# Altium project PCB1.PrjPcb
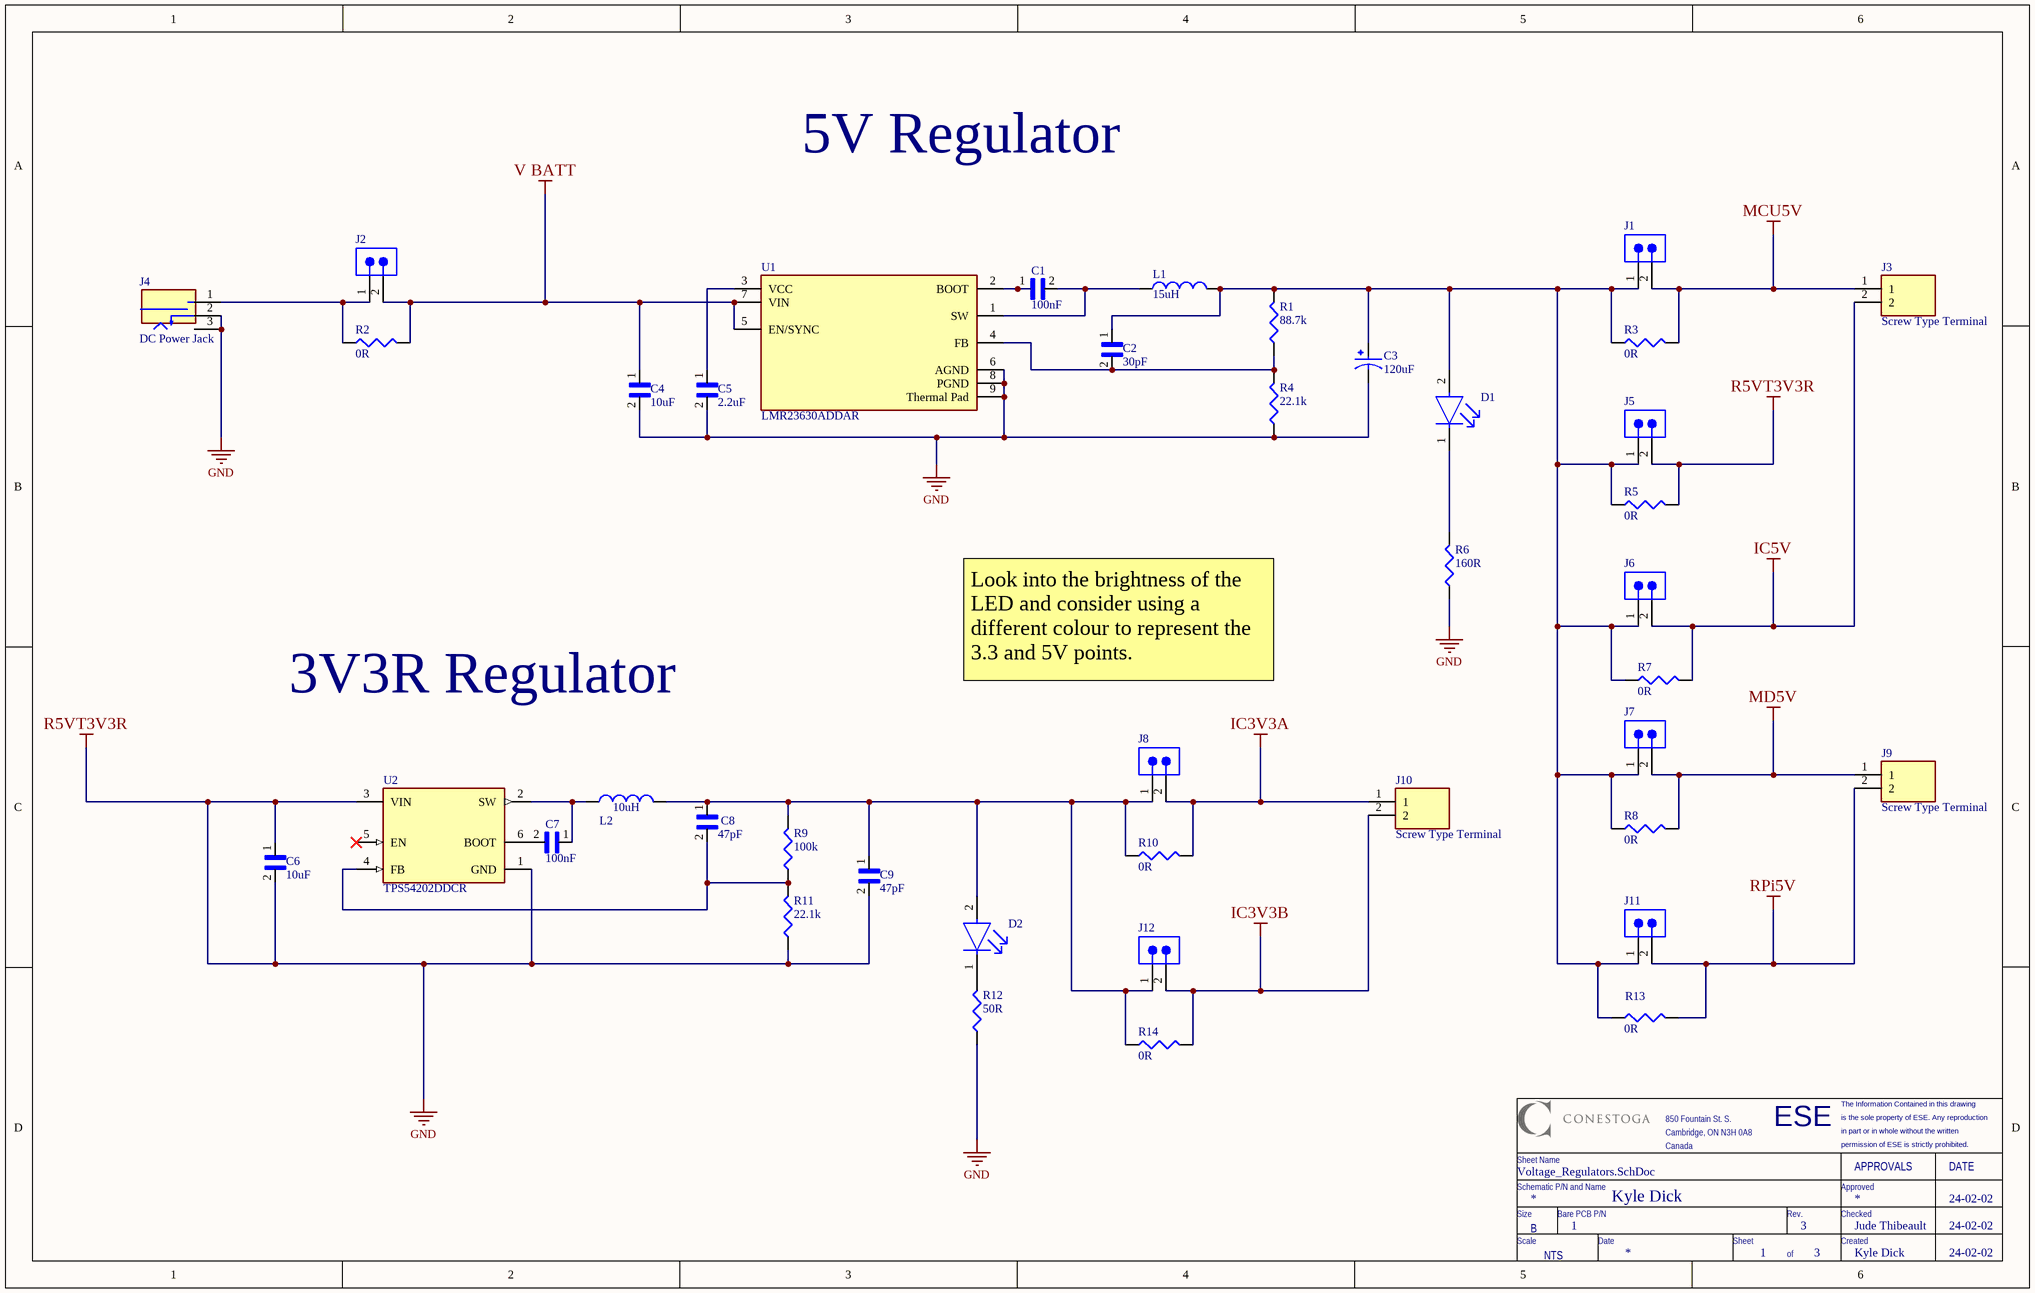
[diagram p0: Voltage_Regulators.SchDoc]
3 sheets, 53 parts. Net scope: flat (ports and power ports of the same name join across sheets).
Board file: PCB1.PcbDoc
Sheets:
  Voltage_Regulators.SchDoc
  Motor Drivers.SchDoc
  Headers.SchDoc

## Sheet Voltage_Regulators.SchDoc
size B; Date: 24-02-02; CheckedBy: Jude Thibeault; Author: Kyle Dick; CompanyName: Conestoga College; DrawnBy: Kyle Dick; Engineer: Kyle Dick; Address1: 850 Fountain St.; DocumentNumber: 1; Revision: 3; SheetNumber: 1; SheetTotal: 3

### Parts
C1  100nF  [10 uF Cap]
C2  30pF  [10 uF Cap]
C3  120uF  [Capacitor 120uF]
C4  10uF  [10 uF Cap]
C5  2.2uF  [10 uF Cap]
C6  10uF  [10 uF Cap]
C7  100nF  [10 uF Cap]
C8  47pF  [10 uF Cap]
C9  47pF  [10 uF Cap]
D1  LTST-C190GKT  [FP-LTST-C190GKT-MFG]  (value not drawn)
D2  LTST-C190GKT  [FP-LTST-C190GKT-MFG]  (value not drawn)
J1  61300211121  [61300211121]  (value not drawn)
J2  61300211121  [61300211121]  (value not drawn)
J3  Screw Type Terminal  [2 Pin Terminal Blue Screw]
J4  DC Power Jack  [GRAVITECH_CON-SOCJ-2155]
J5  61300211121  [61300211121]  (value not drawn)
J6  61300211121  [61300211121]  (value not drawn)
J7  61300211121  [61300211121]  (value not drawn)
J8  61300211121  [61300211121]  (value not drawn)
J9  Screw Type Terminal  [2 Pin Terminal Blue Screw]
J10  Screw Type Terminal  [2 Pin Terminal Blue Screw]
J11  61300211121  [61300211121]  (value not drawn)
J12  61300211121  [61300211121]  (value not drawn)
L1  15uH  [15uH Inductor]
L2  10uH  [10uH Inductor]  (value not drawn)
R1  88.7k  [RESC2112X05M]
R2  0R  [RESC2112X05M]
R3  0R  [RESC2112X05M]
R4  22.1k  [RESC2112X05M]
R5  0R  [RESC2112X05M]
R6  160R  [RESC2112X05M]
R7  0R  [RESC2112X05M]
R8  0R  [RESC2112X05M]
R9  100k  [RESC2112X05M]
R10  0R  [RESC2112X05M]
R11  22.1k  [RESC2112X05M]
R12  50R  [RESC2112X05M]
R13  0R  [RESC2112X05M]
R14  0R  [RESC2112X05M]
U1  LMR23630ADDAR  [FP-DDA0008E-MFG]
U2  TPS54202DDCR  [FP-DDC0006A-IPC_B]

### Nets
GND: C3.2 C4.2 C5.2 C6.1 C6.2 C9.2 J4.2 J4.3 J5.2 R4.1 R5.2 R6.1 R11.1 R12.1 U1.6(AGND) U1.8(PGND) U1.9(Thermal_Pad) U2.1(GND) U2.3(VIN)  [also labelled R5VT3V3R]
IC3V3A: J8.2 J10.1 R10.2
IC3V3B: J10.2 J12.2 R14.2
IC5V: J3.2 J6.2 R7.2
MCU5V: J1.2 J3.1 R3.2
MD5V: J7.2 J9.1 R8.2
RPi5V: J9.2 J11.2 R13.2
V BATT: C4.1 J2.2 R2.2 U1.5(EN/SYNC) U1.7(VIN)
NetC1_1: C1.1 U1.2(BOOT)
NetC1_2: C1.2 L1.1 U1.1(SW)
NetC2_1: C2.1 C3.1 D1.2(A) J1.1 J5.1 J6.1 J7.1 J11.1 L1.2 R1.2 R3.1 R5.1 R7.1 R8.1 R13.1
NetC2_2: C2.2 R1.1 R4.2 U1.4(FB)
NetC5_1: C5.1 U1.3(VCC)
NetC7_1: C7.1 L2.1 U2.2(SW)
NetC7_2: C7.2 U2.6(BOOT)
NetC8_1: C8.1 C9.1 D2.2(A) J8.1 J12.1 L2.2 R9.2 R10.1 R14.1
NetC8_2: C8.2 R9.1 R11.2 U2.4(FB)
NetD1_1: D1.1(C) R6.2
NetD2_1: D2.1(C) R12.2
NetJ2_1: J2.1 J4.1 R2.1

Not connected (* = marked no-connect by the designer): U2 5(EN)*

### Notes on the sheet
- 5V Regulator
- 3V3R Regulator
- Look into the brightness of the LED and consider using a different colour to represent the 3.3 and 5V points.
- Kyle Dick
- ESE
- is the sole property of ESE. Any reproduction
- The Information Contained in this drawing
- Schematic P/N and Name
- Sheet Name
- 850 Fountain St. S.
- Cambridge, ON N3H 0A8
- Canada
- Approved
- in part or in whole without the written
- permission of ESE is strictly prohibited.
- APPROVALS
- DATE
- Size
- Scale
- B
- NTS
- Bare PCB P/N
- Date
- Sheet
- Rev.
- Checked
- Created
- of

### Library data of the parts
C1 C7 = Capacitor 0.1uF: Ceramic Capacitor 1210; MF: Samsung Electro-Mechanics; MP: CL32A106KBJNNNE; Check_prices: https://www.snapeda.com/parts/CL32A106KBJNNNE/Samsung%20Electro-Mechanics/view-part/3598300/?ref=eda; Value: *; SnapEDA_Link: https://www.snapeda.com/parts/CL32A106KBJNNNE/Samsung%20Electro-Mechanics/view-part/3598300/?ref=snap; Package: 1210 Samsung; Availability: Unavailable; Price: None; Supplier 1: Mouser; Supplier Part Number 1: 80-C1210C104K1R
C2 = Capacitor 30pF: Ceramic Capacitor 1210; MF: Samsung Electro-Mechanics; MP: CL32A106KBJNNNE; Check_prices: https://www.snapeda.com/parts/CL32A106KBJNNNE/Samsung%20Electro-Mechanics/view-part/3598300/?ref=eda; Value: *; SnapEDA_Link: https://www.snapeda.com/parts/CL32A106KBJNNNE/Samsung%20Electro-Mechanics/view-part/3598300/?ref=snap; Package: 1210 Samsung; Availability: Unavailable; Price: None; Supplier 1: Digikey; Supplier Part Number 1: 478-KGQ32DCG2D300JTCT-ND
C3 = Capacitor 120uF_1: 120 µF 10 V Aluminum - Polymer Capacitors Radial, Can - SMD 27mOhm 2000 Hrs @ 105°C; MP: 10SVPC120M; Package: None; Price: None; Availability: Unavailable; Value: *
C4 C6 = Capacitor 10uF: Ceramic Capacitor 1210; MF: Samsung Electro-Mechanics; MP: CL32A106KBJNNNE; Check_prices: https://www.snapeda.com/parts/CL32A106KBJNNNE/Samsung%20Electro-Mechanics/view-part/3598300/?ref=eda; Value: *; SnapEDA_Link: https://www.snapeda.com/parts/CL32A106KBJNNNE/Samsung%20Electro-Mechanics/view-part/3598300/?ref=snap; Package: 1210 Samsung; Availability: Unavailable; Price: None; Supplier 1: Avnet; Supplier Part Number 1: CL32A106KBJNNNE
C5 = Capacitor 2.2uF: Ceramic Capacitor 1210; MF: Samsung Electro-Mechanics; MP: CL32A106KBJNNNE; Check_prices: https://www.snapeda.com/parts/CL32A106KBJNNNE/Samsung%20Electro-Mechanics/view-part/3598300/?ref=eda; Value: *; SnapEDA_Link: https://www.snapeda.com/parts/CL32A106KBJNNNE/Samsung%20Electro-Mechanics/view-part/3598300/?ref=snap; Package: 1210 Samsung; Availability: Unavailable; Price: None; Supplier 1: Avnet; Supplier Part Number 1: 41AH7123
C8 C9 = Capacitor 47pF: Ceramic Capacitor 1210; MF: Samsung Electro-Mechanics; MP: CL32A106KBJNNNE; Check_prices: https://www.snapeda.com/parts/CL32A106KBJNNNE/Samsung%20Electro-Mechanics/view-part/3598300/?ref=eda; Value: *; SnapEDA_Link: https://www.snapeda.com/parts/CL32A106KBJNNNE/Samsung%20Electro-Mechanics/view-part/3598300/?ref=snap; Package: 1210 Samsung; Availability: Unavailable; Price: None; Supplier 1: Digikey; Supplier Part Number 1: 478-KGQ32DCG2D300JTCT-ND
D1 D2 = CMP-22017-000005-2: LED GREEN CLEAR CHIP SMD; Dominant Wavelength: 569nm; Reverse Voltage: 5V; Lens Color: Colorless; Viewing Angle: 130°; Voltage: 2V; Forward Current: 30mA; Power Dissipation: 100mW; Luminous Intensity: 6mcd; Number of LEDs: 1; Forward Voltage: 2.1V; Wavelength: 565nm; Test Current: 10mA; Min Operating Temperature: -55°C; Lens Style: Clear; Mount: Surface Mount; Width: 0.8mm; Packaging: Tape and Reel; Lens Transparency: Clear; Case Code (Metric): 1608; Depth: 0.8mm; Case Code (Imperial): 0603; Case/Package: 0603; Number of Pins: 2; Max Operating Temperature: 85°C; Lead Free: Lead Free; Number of Elements: 1; Length: 1.6mm; Height: 0.8mm; Package Quantity: 1; Power Rating: 100mW; Radiation Hardening: No; Illumination Color: Green; Color: Green
J1 J2 J5-J8 J11 J12 = CMP-1712-00002-5: NexarPartId: 20081794; Operating Supply Voltage: 250V; Current Rating: 3A; Gender: Male; Number of Contacts: 2; Pitch: 2.54mm; Connector Type: Male Pin; Contact Resistance: 20mΩ; Contact Plating: Gold; Contact Material: Copper; Number of Pins: 2; Min Operating Temperature: -40°C; Packaging: Bulk; Lead Pitch: 2.54mm; Mount: Through Hole; Orientation: Vertical; RoHS: Compliant; REACH SVHC: No SVHC; Height: 8.94mm; Termination: Through Hole; Number of Positions: 2; Contact Mating Length: 5.9944mm; Color: Black; Contact Gender: Male; Number of Rows: 1; Housing Material: PBT; Lead Free: Lead Free; Voltage Rating: 250V; Max Operating Temperature: 125°C
J3 J9 J10 = Screw Type Terminal: 2~24 Poles, Screw Type, Horizontal, 5.0 Pitch, 22~12 (AWG), Terminal Block Connector; MP: TB002-500-02BE; MF: CUI Devices; Purchase-URL: https://pricing.snapeda.com/search/part/TB002-500-02BE/?ref=eda; Package: None; Price: None; Availability: In Stock; SnapEDA_Link: https://www.snapeda.com/parts/TB002-500-02BE/CUI+Devices/view-part/?ref=snap; Value: *; Check_prices: https://www.snapeda.com/parts/TB002-500-02BE/CUI+Devices/view-part/?ref=eda; CUI_purchase_URL: https://www.cuidevices.com/product/interconnect/connectors/terminal-blocks/tb002-500-series?utm_source=snapeda.com&utm_medium=referral&utm_campaign=snapedaBOM
J4 = DC Power Jack: DC Power Connectors Power Jack/Connector 2.1mm x 5.5mm; MF: Gravitech; MP: CON-SOCJ-2155; Package: None; Value: *; Availability: In Stock; Check_prices: https://www.snapeda.com/parts/CON-SOCJ-2155/Gravitech/view-part/?ref=eda; SnapEDA_Link: https://www.snapeda.com/parts/CON-SOCJ-2155/Gravitech/view-part/?ref=snap; Price: None
L1 = Inductor: 15 µH Unshielded Wirewound Inductor 4 A 36mOhm Max Nonstandard; SimulationGenericComponent: True; Value: 15uH
L2 = Inductor_2: 10 µH Unshielded Wirewound Inductor 2.6 A 60mOhm Max 2424 (6060 Metric); SimulationGenericComponent: True
R1 = Resistor 88.7k: 88.7k 1206 smd; Supplier: Arrow Electronics; Supplier Part Number: RMCF1206FT10K0; Supplier 1: Arrow Electronics; Supplier Part Number 1: ERJ-8ENF8872V
R2 R3 R5 R7 R8 R10 R13 R14 = Resistor 0R: 0R 1206 smd; Supplier: Arrow Electronics; Supplier Part Number: RMCF1206FT10K0; Supplier 1: Avnet; Supplier Part Number 1: 84W7269
R4 R11 = Resistor 22.1k: 22.1k 1206 smd; Supplier: Arrow Electronics; Supplier Part Number: RMCF1206FT10K0; Supplier 1: Avnet; Supplier Part Number 1: RMCF1206FT22K1
R6 = Resistor 160R: 1206 smd; Supplier: Arrow Electronics; Supplier Part Number: RMCF1206FT10K0; Supplier 1: Arrow Electronics; Supplier Part Number 1: RMCF1206FT160R
R9 = Resistor 100k: 100k 1206 smd; Supplier: Arrow Electronics; Supplier Part Number: RMCF1206FT10K0; Supplier 1: Arrow Electronics; Supplier Part Number 1: RMCF1206FT10K0
R12 = Resistor 50R: 50R 1206 smd; Supplier: Arrow Electronics; Supplier Part Number: RMCF1206FT10K0; Supplier 1: Mouser; Supplier Part Number 1: 71-RCP1206W50R0GEB
U1 = CMP-04918-000336-1: IC REG BUCK ADJUSTABLE 3A 8SOPWR; Synchronous Rectifier: Yes; Min Output Voltage: 1V; Switching Frequency: 2.425MHz; Max Input Voltage: 36V; Output Configuration: Positive; Number of Outputs: 1; Min Input Voltage: 4V; Max Output Voltage: 28V; Quiescent Current: 75uA; Mount: Surface Mount; Min Operating Temperature: -40°C; Output Type: Adjustable; Packaging: Tape and Reel; Output Current: 3A; RoHS Compliant: Yes; Max Operating Temperature: 125°C; Lead Free: Lead Free; Number of Pins: 8
U2 = CMP-04918-000439-1: IC REG BUCK ADJ 2A TSOT23-6; Switching Frequency: 500kHz; Quiescent Current: 40uA; Max Output Voltage: 28V; Output Configuration: Positive; Min Output Voltage: 596mV; Min Input Voltage: 4.5V; Synchronous Rectifier: Yes; Output Type: Adjustable; Number of Outputs: 1; Packaging: Tape and Reel; Case/Package: SOT-23-6; RoHS Compliant: Yes; Max Input Voltage: 28V; Max Operating Temperature: 125°C; Min Operating Temperature: -40°C; Output Current: 2A; Lead Free: Lead Free; Mount: Surface Mount

## Sheet Motor Drivers.SchDoc: DC and Stepper Motor
size B; Date: 24-02-04; CheckedBy: Jude Thibeault; Author: Kyle Dick; DrawnBy: Kyle Dick; Engineer: Kyle Dick; Revision: 2; SheetNumber: 2; SheetTotal: 3
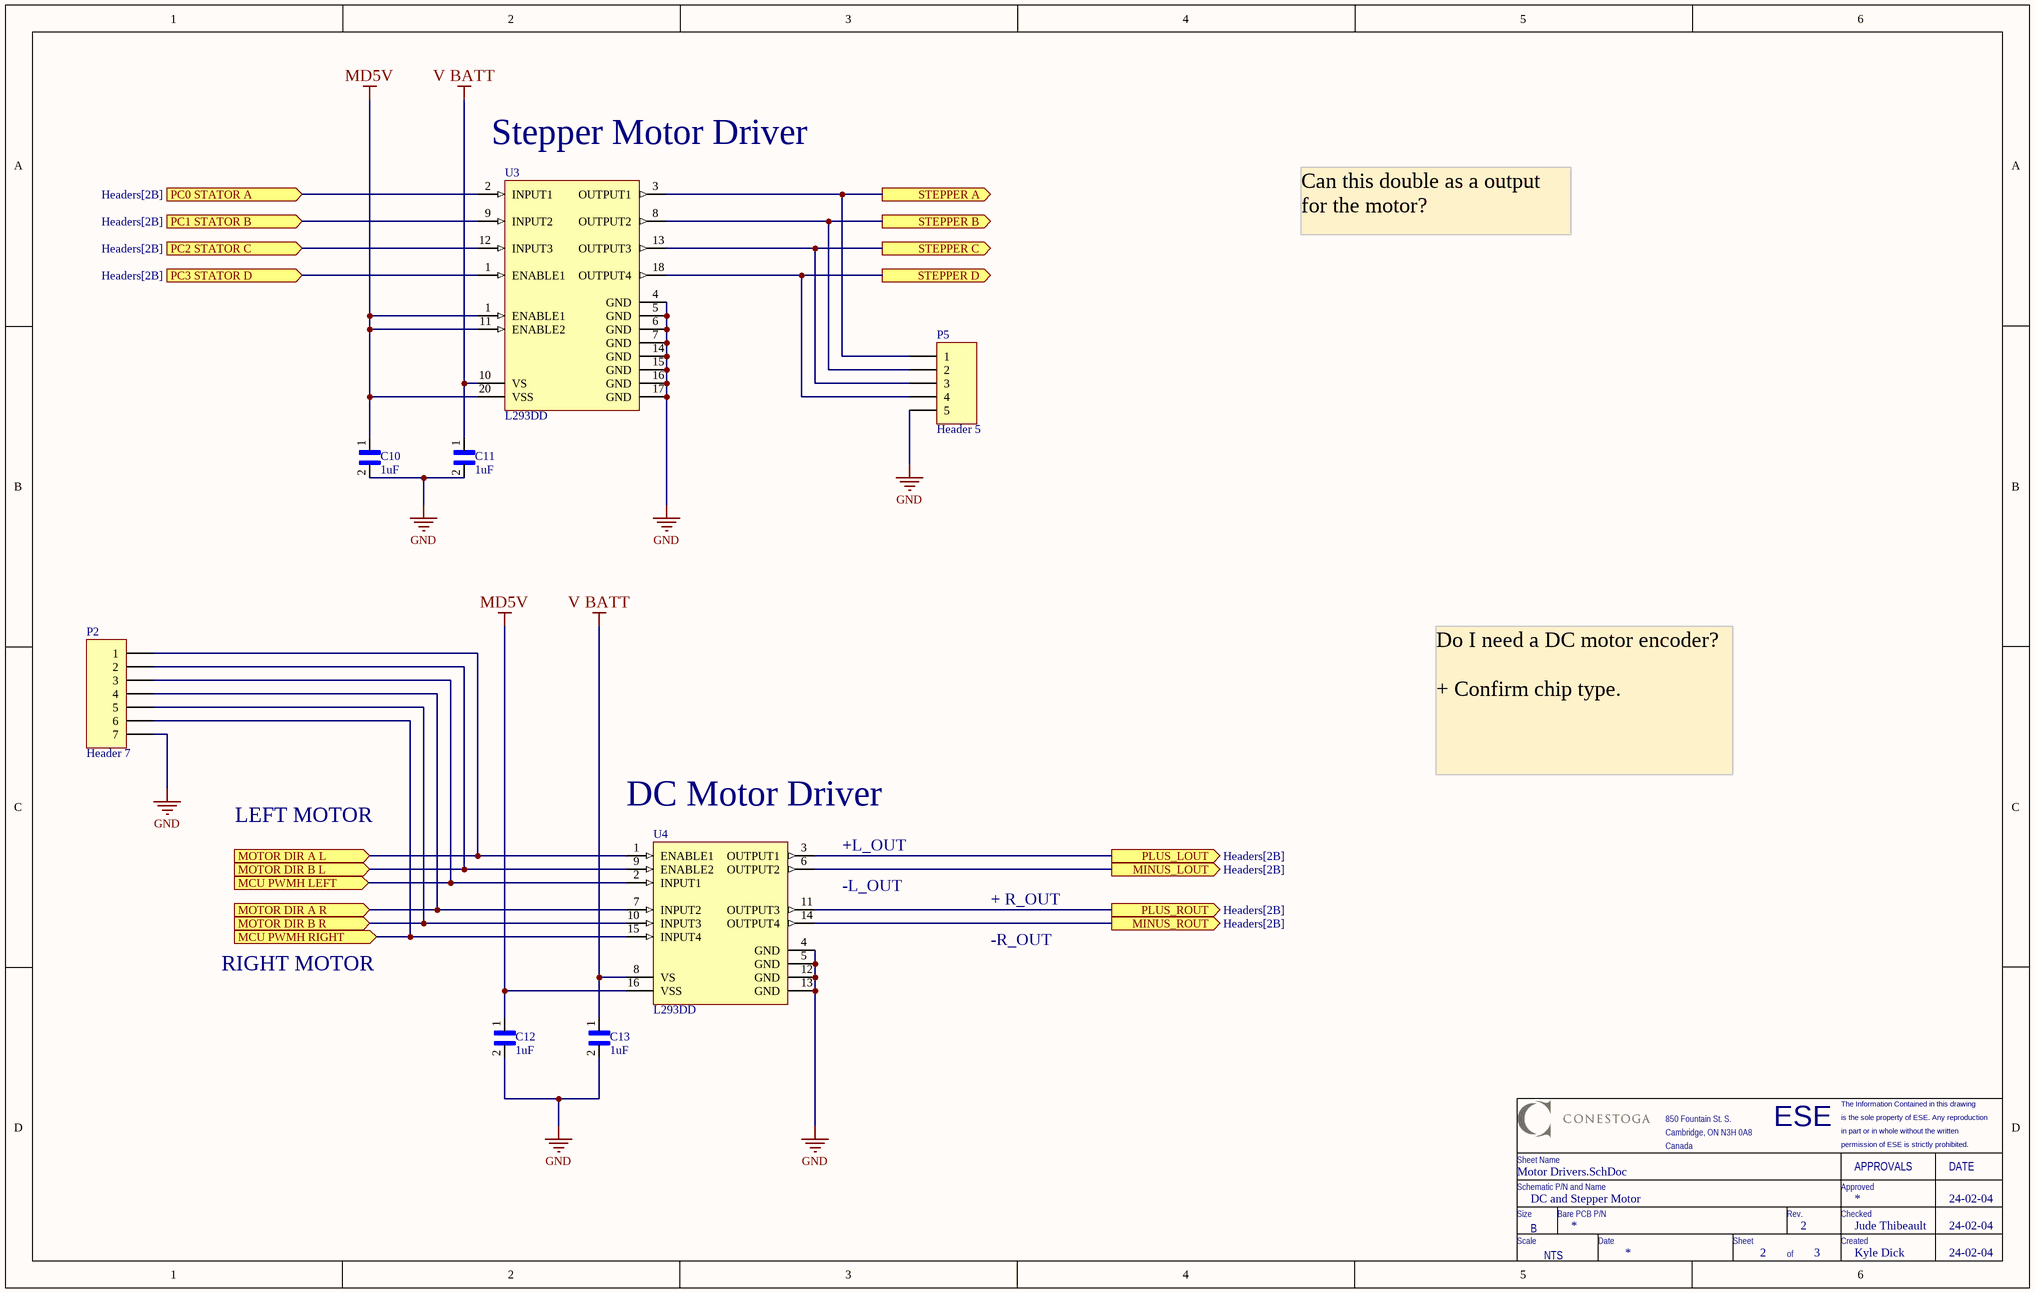
[diagram p1: Motor Drivers.SchDoc]

### Parts
C10  1uF  [10 uF Cap]
C11  1uF  [10 uF Cap]
C12  1uF  [10 uF Cap]
C13  1uF  [10 uF Cap]
P2  Header 7  [HDR1X7]
P5  Header 5  [HDR1X5]
U3  L293DD  [STM-SOIC-20_M]
U4  L293DD  [STM-L293D-16]

### Ports
MCU PWMH LEFT (in, see Headers[2C]), MCU PWMH RIGHT (in, see Headers[2C]), MINUS_LOUT (out, see Headers[2B]), MINUS_ROUT (out, see Headers[2B]), MOTOR DIR A L (in, see Headers[2C]), MOTOR DIR A R (in, see Headers[2C]), MOTOR DIR B L (in, see Headers[2C]), MOTOR DIR B R (in, see Headers[2C]), PC0 STATOR A (in, see Headers[2B]), PC1 STATOR B (in, see Headers[2B]), PC2 STATOR C (in, see Headers[2B]), PC3 STATOR D (in, see Headers[2B]), PLUS_LOUT (out, see Headers[2B]), PLUS_ROUT (out, see Headers[2B]), STEPPER A (out, see Headers[2A]), STEPPER B (out, see Headers[2A]), STEPPER C (out, see Headers[2A]), STEPPER D (out, see Headers[2A])

### Nets
GND: C10.2 C11.2 C12.2 C13.2 P2.7 P5.5 U3.4(GND) U3.5(GND) U3.6(GND) U3.7(GND) U3.14(GND) U3.15(GND) U3.16(GND) U3.17(GND) U4.4(GND) U4.5(GND) U4.12(GND) U4.13(GND)
MD5V: C10.1 C12.1 U3.1(ENABLE1) U3.11(ENABLE2) U3.20(VSS) U4.16(VSS)
V BATT: C11.1 C13.1 U3.10(VS) U4.8(VS)
NetJ13_01: U3.2(INPUT1) ; port PC0 STATOR A
NetJ13_02: U3.9(INPUT2) ; port PC1 STATOR B
NetJ13_03: U3.12(INPUT3) ; port PC2 STATOR C
NetJ13_04: U3.1(ENABLE1) ; port PC3 STATOR D
NetJ14_01: P2.1 U4.1(ENABLE1) ; port MOTOR DIR A L
NetJ14_02: P2.2 U4.9(ENABLE2) ; port MOTOR DIR B L
NetJ14_03: P2.3 U4.2(INPUT1) ; port MCU PWMH LEFT
NetJ14_04: P2.4 U4.7(INPUT2) ; port MOTOR DIR A R
NetJ14_05: P2.5 U4.10(INPUT3) ; port MOTOR DIR B R
NetJ14_06: P2.6 U4.15(INPUT4) ; port MCU PWMH RIGHT
NetP5_1: P5.1 U3.3(OUTPUT1) ; port STEPPER A
NetP5_2: P5.2 U3.8(OUTPUT2) ; port STEPPER B
NetP5_3: P5.3 U3.13(OUTPUT3) ; port STEPPER C
NetP5_4: P5.4 U3.18(OUTPUT4) ; port STEPPER D
NetP33_1: U4.3(OUTPUT1) ; port PLUS_LOUT
NetP33_2: U4.6(OUTPUT2) ; port MINUS_LOUT
NetP33_3: U4.11(OUTPUT3) ; port PLUS_ROUT
NetP33_4: U4.14(OUTPUT4) ; port MINUS_ROUT

### Notes on the sheet
- (near U3) Stepper Motor Driver
- Can this double as a output for the motor?
- Do I need a DC motor encoder?
  + Confirm chip type.
- LEFT MOTOR
- (near U4) DC Motor Driver
- +L_OUT
- -L_OUT
- + R_OUT
- RIGHT MOTOR
- -R_OUT
- ESE
- is the sole property of ESE. Any reproduction
- The Information Contained in this drawing
- Schematic P/N and Name
- Sheet Name
- 850 Fountain St. S.
- Cambridge, ON N3H 0A8
- Canada
- Approved
- in part or in whole without the written
- permission of ESE is strictly prohibited.
- APPROVALS
- DATE
- Size
- Scale
- B
- NTS
- Bare PCB P/N
- Date
- Sheet
- Rev.
- Checked
- Created
- of

### Library data of the parts
C10-C13 = Capacitor 1uF: Ceramic Capacitor 1210; MF: Samsung Electro-Mechanics; MP: CL32A106KBJNNNE; Check_prices: https://www.snapeda.com/parts/CL32A106KBJNNNE/Samsung%20Electro-Mechanics/view-part/3598300/?ref=eda; Value: *; SnapEDA_Link: https://www.snapeda.com/parts/CL32A106KBJNNNE/Samsung%20Electro-Mechanics/view-part/3598300/?ref=snap; Package: 1210 Samsung; Availability: Unavailable; Price: None; Supplier 1: Arrow Electronics; Supplier Part Number 1: CL32B105KCJNNNE
P2 = Header 7: Header, 7-Pin Male; MPN: PEC07SFAN; PN: S1212E-07-ND; URL: http://www.digikey.ca/product-detail/en/PEC07SFAN/S1212E-07-ND
P5 = Header 5: Header, 5-Pin Male; MPN: PEC05SFAN; PN: S1212E-05-ND; URL: http://www.digikey.ca/product-detail/en/PEC05SFAN/S1212E-05-ND/859446
U3 = CMP-1771-00003-1: Push-Pull Four Channel Driver with Diodes, 4.5 to 36 V, 20-Pin SOIC, RoHS, Tube; Voltage Rating: 50 V; Power Rating: 100 mW; Case\Package: 0603; Resistance: 15 kohm; Tolerance: 1%; REACH SVHC: Unknown; Case Code (Imperial): 0603; ComponentLink2Description: Datasheet; ComponentLink2URL: http://www.st.com/content/ccc/resource/technical/document/datasheet/04/ac/22/f9/20/5d/43/a1/CD00000059.pdf/files/CD00000059.pdf/jcr:content/translations/en.CD00000059.pdf; Max Operating Temperature: 155 degC; Width: 0.8 mm; ComponentLink1URL: http://www.st.com/; ComponentLink1Description: Manufacturer URL; Length: 1.6 mm; Package Quantity: 5000; RoHSCompliant: true; Height: 0.45 mm; Mount: Surface Mount; PackageDescription: 20-Pin Small Outline Integrated Circuit, Body 12.8 x 7.5 mm, Pitch 1.27 mm; PackageReference: SOIC-20; Packaging: Tape and Reel; Min Operating Temperature: -55 degC; Case Code (Metric): 1608; DatasheetVersion: Jul-03
U4 = CMP-2000-06524-1: Push-Pull Four Channel Driver with Diode, 4.5 to 36 V, -40 to 150 degC, 16-Pin PDIP, RoHS, Tube; PartNumber: L293D; Manufacturer: STMicroelectronics; Number of Outputs: 4; Current - Peak Output: 1.2A; Current - Output / Channel: 600mA; Input Type: Non-Inverting; Other Related Documents: L293DViewAllSpecifications; Dynamic Catalog: HalfBridge; Voltage - Supply: 4.5V~36V; Other Names: 497-2936-5; Package / Case: 16-DIP(0.300",7.62mm); Operating Temperature: -40°C~150°C; Datasheet URL: http://www.st.com/st-web-ui/static/active/en/resource/technical/document/datasheet/CD00000059.pdf; Supplier Device Package: 16-PowerDIP; Packaging: Tube; Package Description: 16-Pin Thru-Hole Dual-In-Line, Body 20 x 6.85 mm, Pitch 2.54 mm; Standard Package: 25; Datasheet Version: 07/2003; On-State Resistance: -; Manufacturer URL: http://www.st.com/; Category: IntegratedCircuits(ICs); Family: PMIC-MOSFET,BridgeDrivers-InternalSwitch; Type: HalfBridge; Series: -; Mounting Technology: ThroughHole; Package Reference: DIP-16; Mounting Type: ThroughHole

## Sheet Headers.SchDoc
size B; SheetNumber: 3; SheetTotal: 3
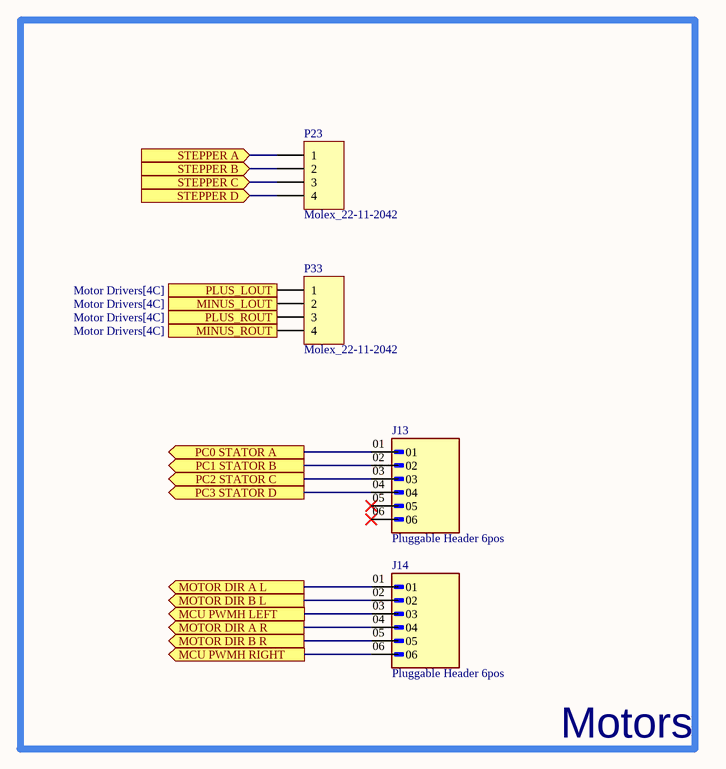
[diagram p2: Headers.SchDoc]

### Parts
J13  Pluggable Header 6pos  [PHOENIX_1757284]
J14  Pluggable Header 6pos  [PHOENIX_1757284]
P23  Molex_22-11-2042  [MOLEX-22-11-2042]
P33  Molex_22-11-2042  [MOLEX-22-11-2042]

### Blocks framed on the sheet
Motors: J13 J14 P23 P33

### Ports
MCU PWMH LEFT (out, see Motor Drivers[1C]), MCU PWMH RIGHT (out, see Motor Drivers[1C]), MINUS_LOUT (in, see Motor Drivers[4C]), MINUS_ROUT (in, see Motor Drivers[4C]), MOTOR DIR A L (out, see Motor Drivers[1C]), MOTOR DIR A R (out, see Motor Drivers[1C]), MOTOR DIR B L (out, see Motor Drivers[1C]), MOTOR DIR B R (out, see Motor Drivers[1C]), PC0 STATOR A (out, see Motor Drivers[1A]), PC1 STATOR B (out, see Motor Drivers[1A]), PC2 STATOR C (out, see Motor Drivers[1A]), PC3 STATOR D (out, see Motor Drivers[1A]), PLUS_LOUT (in, see Motor Drivers[4C]), PLUS_ROUT (in, see Motor Drivers[4C]), STEPPER A (in, see Motor Drivers[3A]), STEPPER B (in, see Motor Drivers[3A]), STEPPER C (in, see Motor Drivers[3A]), STEPPER D (in, see Motor Drivers[3A])

### Nets
NetJ13_01: J13.01 ; port PC0 STATOR A
NetJ13_02: J13.02 ; port PC1 STATOR B
NetJ13_03: J13.03 ; port PC2 STATOR C
NetJ13_04: J13.04 ; port PC3 STATOR D
NetJ14_01: J14.01 ; port MOTOR DIR A L
NetJ14_02: J14.02 ; port MOTOR DIR B L
NetJ14_03: J14.03 ; port MCU PWMH LEFT
NetJ14_04: J14.04 ; port MOTOR DIR A R
NetJ14_05: J14.05 ; port MOTOR DIR B R
NetJ14_06: J14.06 ; port MCU PWMH RIGHT
NetP5_1: P23.1 ; port STEPPER A
NetP5_2: P23.2 ; port STEPPER B
NetP5_3: P23.3 ; port STEPPER C
NetP5_4: P23.4 ; port STEPPER D
NetP33_1: P33.1 ; port PLUS_LOUT
NetP33_2: P33.2 ; port MINUS_LOUT
NetP33_3: P33.3 ; port PLUS_ROUT
NetP33_4: P33.4 ; port MINUS_ROUT

Not connected (* = marked no-connect by the designer): J13 05* 06*

### Notes on the sheet
- ESE
- is the sole property of ESE. Any reproduction
- The Information Contained in this drawing
- Schematic P/N and Name
- Sheet Name
- 850 Fountain St. S.
- Cambridge, ON N3H 0A8
- Canada
- Approved
- in part or in whole without the written
- permission of ESE is strictly prohibited.
- APPROVALS
- DATE
- Size
- Scale
- B
- NTS
- Bare PCB P/N
- Date
- Sheet
- Rev.
- Checked
- Created
- of

### Library data of the parts
J13 J14 = Pluggable Header 6pos: Pluggable Header 5.08mm 12AWG 320V 12A 6 Position COMBICON MSTBA Series | Phoenix Contact 1757284; SnapEDA_Link: https://www.snapeda.com/parts/1757284/Phoenix+Contact/view-part/?ref=snap; Package: None; Value: *; MF: Phoenix Contact; MP: 1757284; Check_prices: https://www.snapeda.com/parts/1757284/Phoenix+Contact/view-part/?ref=eda
P23 P33 = Molex_22-11-2042: CONN HEADER 4POS .100 VERT GOLD; MPN: 0022112042; PN: WM2702-ND; URL: http://www.digikey.ca/product-detail/en/0022112042/WM2702-ND

## Nets that join several sheets
GND: Voltage_Regulators (19 pins), Motor Drivers (18 pins)
MD5V: Voltage_Regulators (J7.2 J9.1 R8.2), Motor Drivers (6 pins)
V BATT: Voltage_Regulators (5 pins), Motor Drivers (C11.1 C13.1 U3.10 U4.8)
NetJ13_01: Motor Drivers (U3.2), Headers (J13.01)
NetJ13_02: Motor Drivers (U3.9), Headers (J13.02)
NetJ13_03: Motor Drivers (U3.12), Headers (J13.03)
NetJ13_04: Motor Drivers (U3.1), Headers (J13.04)
NetJ14_01: Motor Drivers (P2.1 U4.1), Headers (J14.01)
NetJ14_02: Motor Drivers (P2.2 U4.9), Headers (J14.02)
NetJ14_03: Motor Drivers (P2.3 U4.2), Headers (J14.03)
NetJ14_04: Motor Drivers (P2.4 U4.7), Headers (J14.04)
NetJ14_05: Motor Drivers (P2.5 U4.10), Headers (J14.05)
NetJ14_06: Motor Drivers (P2.6 U4.15), Headers (J14.06)
NetP5_1: Motor Drivers (P5.1 U3.3), Headers (P23.1)
NetP5_2: Motor Drivers (P5.2 U3.8), Headers (P23.2)
NetP5_3: Motor Drivers (P5.3 U3.13), Headers (P23.3)
NetP5_4: Motor Drivers (P5.4 U3.18), Headers (P23.4)
NetP33_1: Motor Drivers (U4.3), Headers (P33.1)
NetP33_2: Motor Drivers (U4.6), Headers (P33.2)
NetP33_3: Motor Drivers (U4.11), Headers (P33.3)
NetP33_4: Motor Drivers (U4.14), Headers (P33.4)